# EAGLE board LinTempCont_4ch_V1_0 (EAGLE 6.5.0)
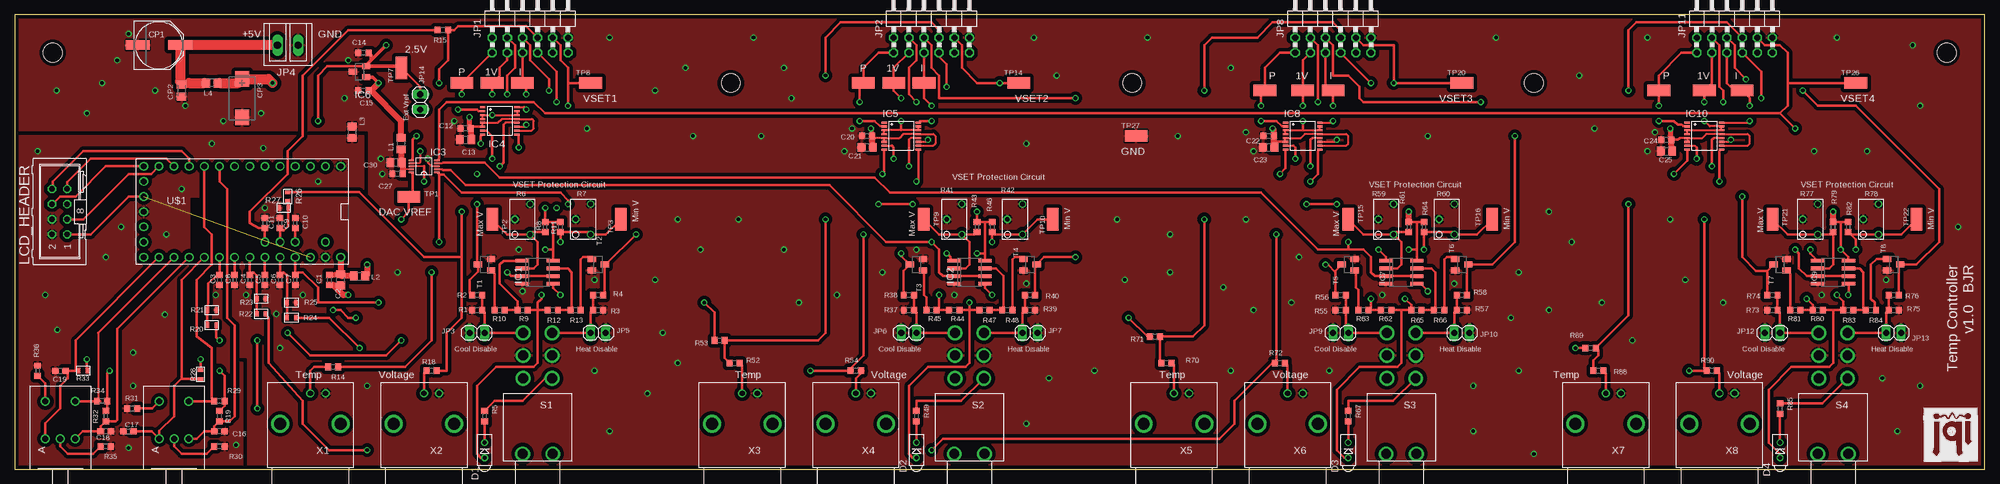
[diagram p5: board, top side]
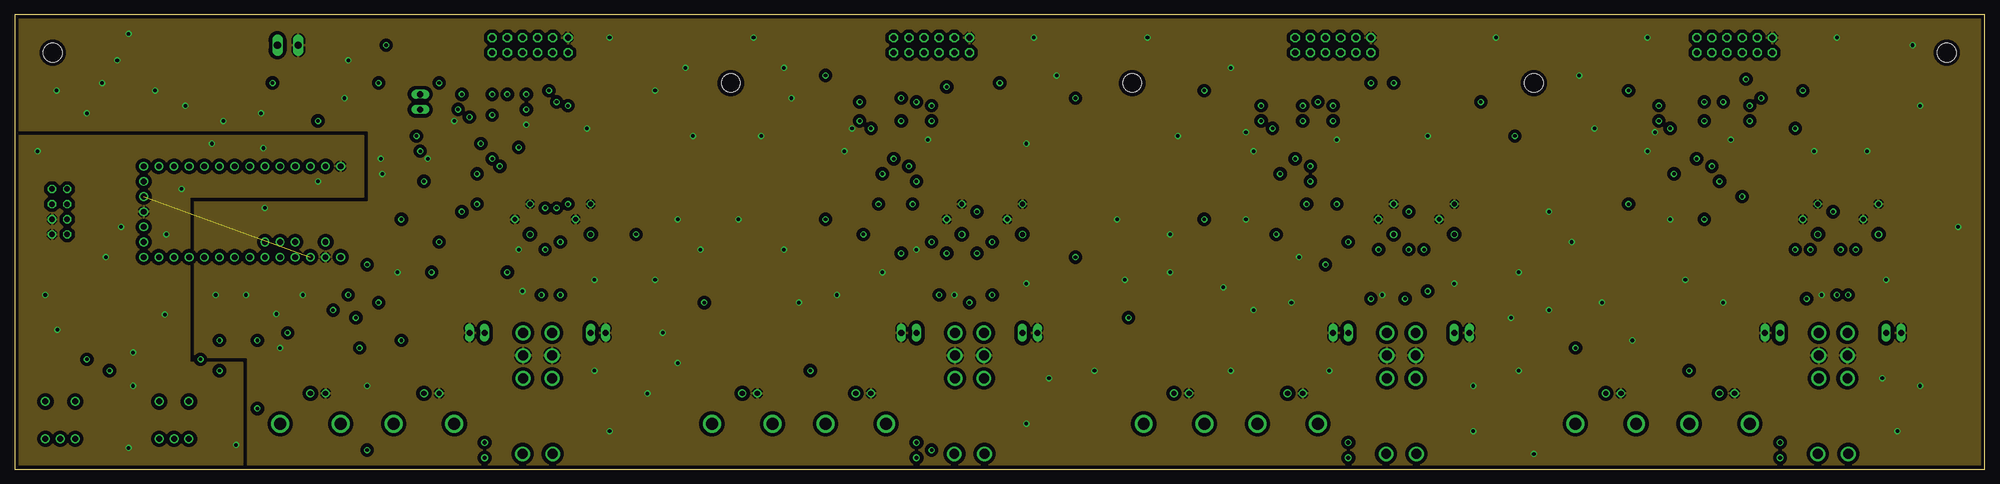
[diagram p6: board, inner layer Route2]
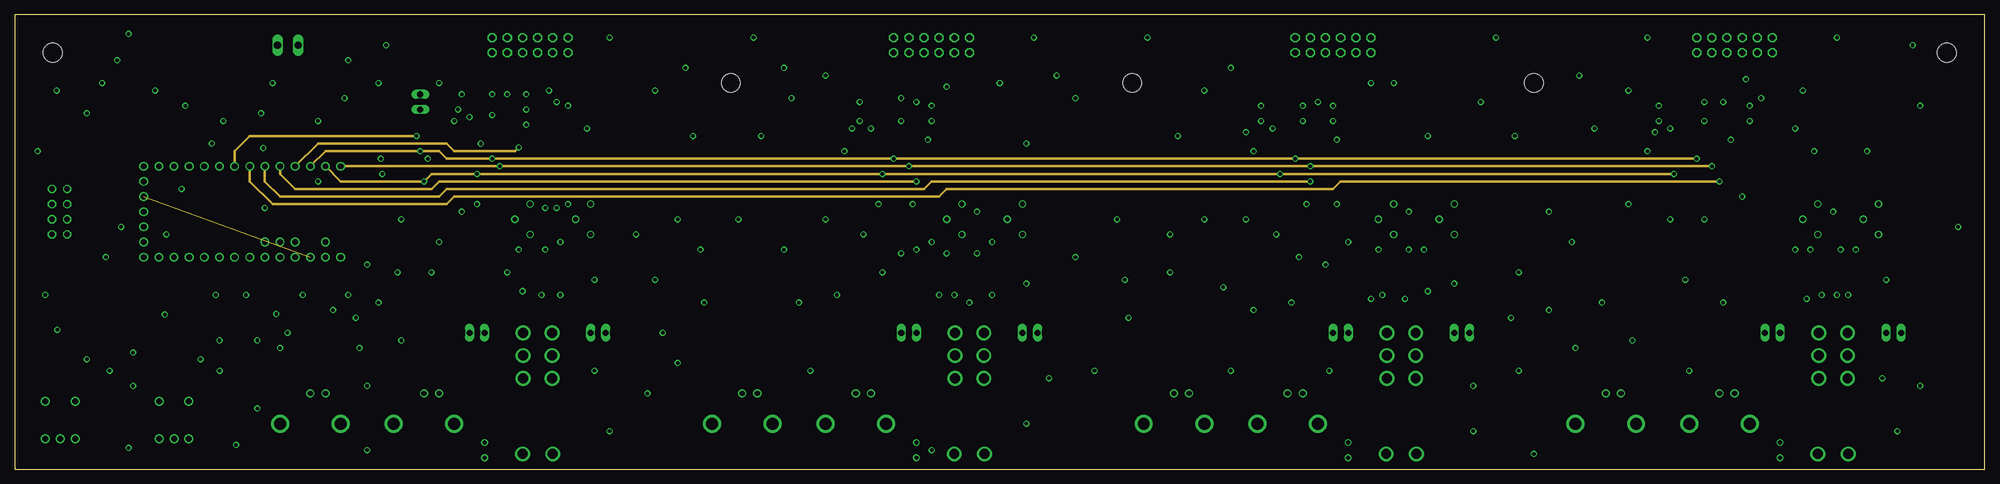
[diagram p7: board, inner layer Route15]
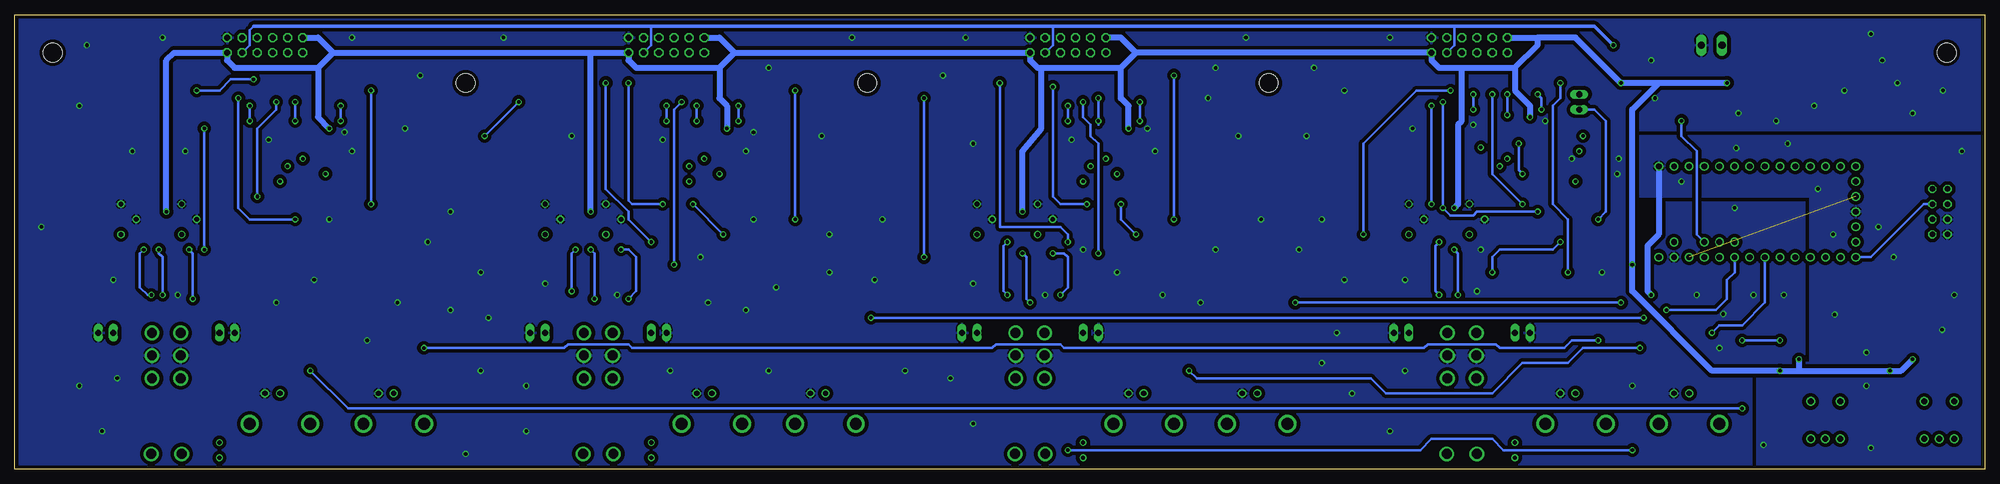
[diagram p8: board, bottom side, seen from below]

Size 330.2 x 76.2 mm. Coordinates in mm from the lower left corner, seen from the top.
Outline: 0,0 330.2,0 330.2,76.2 0,76.2 0,0
Copper layers (1+2*15+16): Top 0.0178mm / dielectric 12mil / Route2 0.0356mm / dielectric 28mil / Route15 0.0356mm / dielectric 12mil / Bottom 0.0178mm
Design rules "SSC-EAGLE-4Lyr_v1.0.0.3": minimum track width 6mil, minimum drill 8mil, track to track 6mil, track to pad 6mil, pad to pad 6mil, via to via 6mil, smd to smd 6mil, copper to edge 20mil, drill to drill 16mil, minimum pad ring 8mil, minimum via ring 8mil, stop-mask expansion 3mil, vias tented up to drill 0mil, thermal gap 10mil
Holes 3.17 mm at 6.35,69.85 323.85,69.85 254.63,64.77 187.32,64.77 120.02,64.77

## Footprints (pad centres in the part's own frame; a part is rotated, then mirrored left to right if it is on the bottom)
0603 = smd 1 x 1.1: 1 -0.85,0; 2 0.85,0
0805 = smd 1.3 x 1.5: 1 -0.95,0; 2 0.95,0
C0603 = smd 1.1 x 1: 1 -0.85,0; 2 0.85,0
PANASONIC_F = smd 4 x 1.6: + 3.55,0; - -3.55,0
C0805K = smd 1.3 x 1.6: 1 -1,0; 2 1,0
CT7343 = smd 2.6 x 2.4: + -3.2,0; - 3.2,0
HLMP--F0010 = drill 0.7: A 1.27,0; C -1.27,0
PEC092320FS = drill 1: A 0,-2.5; B 0,2.5; C 0,0; D -6.25,-2.5; E -6.25,2.5
SO08 = smd 2.2 x 0.6: 1 -2.6,1.905; 2 -2.6,0.635; 3 -2.6,-0.635; 4 -2.6,-1.905; 5 2.6,-1.905; 6 2.6,-0.635; 7 2.6,0.635; 8 2.6,1.905
MSOP10 = smd 0.9 x 0.3: 1 -2.16,1; 2 -2.16,0.5; 3 -2.16,0; 4 -2.16,-0.5; 5 -2.16,-1; 6 2.16,-1; 7 2.16,-0.5; 8 2.16,0; 9 2.16,0.5; 10 2.16,1
TSSOP16 = smd 0.9 x 0.35: 1 -2.875,2.275; 2 -2.875,1.625; 3 -2.875,0.975; 4 -2.875,0.325; 5 -2.875,-0.325; 6 -2.875,-0.975; 7 -2.875,-1.625; 8 -2.875,-2.275; 9 2.875,-2.275; 10 2.875,-1.625; 11 2.875,-0.975; 12 2.875,-0.325; 13 2.875,0.325; 14 2.875,0.975; 15 2.875,1.625; 16 2.875,2.275
SOT-23 = smd 1.4 x 1: 1 -1.1,0.95; 2 -1.1,-0.95; 3 1.1,0
2X06/90 = drill 1.016 octagon: 1 -6.35,-6.35; 2 -6.35,-3.81; 3 -3.81,-6.35; 4 -3.81,-3.81; 5 -1.27,-6.35; 6 -1.27,-3.81; 7 1.27,-6.35; 8 1.27,-3.81; 9 3.81,-6.35; 10 3.81,-3.81; 11 6.35,-6.35; 12 6.35,-3.81
1X02 = drill 1.016 long: 1 -1.27,0; 2 1.27,0
1X02_SCRWTRM = drill 1.2 long: 1 -1.79,-0.01; 2 1.71,-0.01
ML08 = drill 0.914 octagon: 1 -3.81,-1.143; 2 -3.81,1.397; 3 -1.27,-1.143; 4 -1.27,1.397; 5 1.27,-1.143; 6 1.27,1.397; 7 3.81,-1.143; 8 3.81,1.397
64WPOT = drill 0.8: P$1 -1.27,2.54; P$2 1.27,0; P$3 -1.27,-2.54
R_0603 = smd 0.6 x 0.9: P$1 -0.75,0; P$2 0.75,0
E-SWITCH-100-M7 = drill 1.651: P$1 2.413,0; P$2 2.413,-3.81; P$3 2.413,-7.62; P$4 -2.413,0; P$5 -2.413,-3.81; P$6 -2.413,-7.62; P$7 -2.54,12.7; P$8 2.54,12.7
1206TESTPAD = smd 3.81 x 1.93: P$1 0,0
TEENSY_3.1+4 = drill 0.965: 0 -7.62,15.24; 1 -7.62,12.7; 2 -7.62,10.16; 3 -7.62,7.62; 3.3V 7.62,12.7; 3.3V1 -2.54,-15.24; 4 -7.62,5.08; 5 -7.62,2.54; 6 -7.62,0; 7 -7.62,-2.54; 8 -7.62,-5.08; 9 -7.62,-7.62; 10 -7.62,-10.16; 11 -7.62,-12.7; 12 -7.62,-15.24; 13 7.62,-15.24; 14/A0 7.62,-12.7; 15/A1 7.62,-10.16; 16/A2 7.62,-7.62; 17/A3 7.62,-5.08; 18/A4 7.62,-2.54; 19/A5 7.62,0; 20/A6 7.62,2.54; 21/A7 7.62,5.08; 22/A8 7.62,7.62; 23/A9 7.62,10.16; A10 5.08,7.62; A11 5.08,5.08; A14 5.08,-15.24; AGND 7.62,15.24; AREF 5.08,10.16; GND -7.62,17.78; GND1 0,-15.24; PGM 2.54,-15.24; VBAT -5.08,-15.24; VIN 7.62,17.78; VUSB 5.08,15.24
BNC90 = drill 0.9 pad 1.27: 1 0,-5.08; 2 -2.54,-5.08 | drill 2 pad 2.032: ANCHOR1 -5.08,0; ANCHOR2 5.08,0

## Placement (x,y rotation side)
C1  0.1uF  [0603]  52.7,31.75 90 top
C2  10uF  [0805]  54.61,31.75 90 top
C3  0.1uF  [0603]  34.29,31.75 90 top
C4  0.1uF  [0603]  39.37,31.75 90 top
C5  0.1uF  [0603]  41.91,31.75 90 top
C6  0.1uF  [0603]  44.45,31.75 90 top
C7  0.1uF  [0603]  46.99,31.75 90 top
C8  0.1uF  [0603]  36.83,31.75 90 top
C9  0.1uF  [0603]  44.45,41.27 270 top
C10  1000pF  [0603]  46.99,41.27 270 top
C11  0.1uF  [0603]  41.91,41.27 270 top
C12  0.1uF  [0603]  75.56,57.15 0 top
C13  10uF  [0805]  75.56,55.24 0 top
C14  1000pF  [0603]  58.42,69.85 0 top
C15  0.1uF  [0603]  58.42,63.5 0 top
C16  10nF  [C0603]  34.29,6.35 180 top
C17  10nF  [C0603]  19.05,6.35 0 top
C18  10nF  [C0603]  15.24,6.35 180 top
C19  10nF  [C0603]  7.62,16.51 0 top
C20  0.1uF  [0603]  142.88,55.88 0 top
C21  10uF  [0805]  142.88,53.98 0 top
C22  0.1uF  [0603]  210.19,55.88 0 top
C23  10uF  [0805]  210.19,53.98 0 top
C24  0.1uF  [0603]  276.86,55.24 0 top
C25  10uF  [0805]  276.86,53.34 0 top
C27  0.1uF  [0603]  64.14,49.53 0 top
C30  10uF  [0805]  63.88,51.44 0 top
CP1  220uF  [PANASONIC_F]  24.13,71.12 0 top
CP2  10uF  [C0805K]  27.94,63.5 270 top
CP3  47uF  [CT7343]  38.1,62.23 270 top
D1  [HLMP--F0010]  78.74,3.17 270 top
D2  [HLMP--F0010]  151.13,3.17 270 top
D3  [HLMP--F0010]  223.52,3.17 270 top
D4  [HLMP--F0010]  295.91,3.17 270 top
ENC1  PEC09  [PEC092320FS]  26.67,5.08 270 top
ENC2  PEC09  [PEC092320FS]  7.62,5.08 270 top
IC1  LM393D  [SO08]  87.63,33.02 0 top
IC2  LM393D  [SO08]  160.02,33.02 0 top
IC3  AD5624R  [MSOP10]  68.58,50.8 180 top
IC4  AD5262  [TSSOP16]  81.28,58.42 0 top
IC5  AD5262  [TSSOP16]  148.59,55.88 0 top
IC6  [SOT-23]  57.78,66.67 180 top
IC7  LM393D  [SO08]  232.41,33.02 0 top
IC8  AD5262  [TSSOP16]  215.9,55.88 0 top
IC9  LM393D  [SO08]  304.8,33.02 0 top
IC10  AD5262  [TSSOP16]  283.21,55.88 0 top
JP1  [2X06/90]  86.36,76.2 0 top
JP2  [2X06/90]  153.67,76.2 0 top
JP3  [1X02]  77.47,22.86 180 top
JP4  [1X02_SCRWTRM]  45.72,71.12 180 top
JP5  [1X02]  97.79,22.86 0 top
JP6  [1X02]  149.86,22.86 180 top
JP7  [1X02]  170.18,22.86 0 top
JP8  [2X06/90]  220.98,76.2 0 top
JP9  [1X02]  222.25,22.86 180 top
JP10  [1X02]  242.57,22.86 0 top
JP11  [2X06/90]  288.29,76.2 0 top
JP12  [1X02]  294.64,22.86 180 top
JP13  [1X02]  314.96,22.86 0 top
JP14  [1X02]  67.94,61.59 90 top
L1  Ferrite 1k  [0805]  64.77,54.61 90 top
L2  Ferrite 1k  [0805]  57.78,32.38 0 top
L3  Ferrite 1k  [0805]  56.52,56.52 270 top
L4  Ferrite 1k  [0805]  33.02,64.77 180 top
LCD_HEADER  [ML08]  7.62,43.18 90 top
R1  4.3k  [0603]  77.47,26.67 0 top
R2  1.5k  [0603]  77.47,29.21 180 top
R3  4.3k  [0603]  97.79,26.67 180 top
R4  1.5k  [0603]  97.79,29.21 0 top
R5  330  [0603]  78.74,8.89 270 top
R6  10k  [64WPOT]  85.09,41.91 180 top
R7  10k  [64WPOT]  95.25,41.91 180 top
R8  10k  [0603]  88.9,40.64 90 top
R9  10k  [0603]  85.09,26.67 0 top
R10  10k  [0603]  81.28,26.67 0 top
R11  33k  [0603]  91.44,40.64 90 top
R12  10k  [0603]  90.17,26.67 180 top
R13  10k  [0603]  93.98,26.67 180 top
R14  1.0k  [0603]  53.34,17.14 180 top
R15  1.0k  [0603]  71.75,73.66 180 top
R18  1.0k  [0603]  69.85,16.51 180 top
R19  10k  [0603]  34.29,8.89 90 top
R20  10k 1%  [R_0603]  33.02,24.13 0 top
R21  10k 1%  [R_0603]  33.02,26.67 180 top
R22  10k 1%  [R_0603]  41.27,26.04 0 top
R23  10k 1%  [R_0603]  41.27,28.57 180 top
R24  10k 1%  [R_0603]  46.35,25.4 0 top
R25  10k 1%  [R_0603]  46.35,27.94 180 top
R26  10k 1%  [R_0603]  45.72,45.72 90 top
R27  10k 1%  [R_0603]  45.09,43.81 0 top
R28  10k  [R_0603]  31.11,15.88 90 top
R29  10k  [0603]  34.29,11.43 0 top
R30  50  [0603]  34.29,3.81 180 top
R31  50  [0603]  19.68,10.16 0 top
R32  10k  [0603]  15.24,8.89 90 top
R33  10k  [R_0603]  11.43,16.51 0 top
R34  10k  [0603]  14.61,11.43 0 top
R35  50  [0603]  15.24,3.81 180 top
R36  50  [0603]  3.81,16.51 270 top
R37  4.3k  [0603]  149.86,26.67 0 top
R38  1.5k  [0603]  149.86,29.21 180 top
R39  4.3k  [0603]  170.18,26.67 180 top
R40  1.5k  [0603]  170.18,29.21 0 top
R41  10k  [64WPOT]  157.48,41.91 180 top
R42  10k  [64WPOT]  167.64,41.91 180 top
R43  10k  [0603]  161.29,40.64 90 top
R44  10k  [0603]  157.48,26.67 0 top
R45  10k  [0603]  153.67,26.67 0 top
R46  33k  [0603]  163.83,40.64 90 top
R47  10k  [0603]  162.56,26.67 180 top
R48  10k  [0603]  166.37,26.67 180 top
R49  330  [0603]  151.13,8.89 270 top
R52  1.0k  [0603]  120.65,17.78 0 top
R53  1.0k  [0603]  118.11,21.59 180 top
R54  1.0k  [0603]  140.97,16.51 0 top
R55  4.3k  [0603]  222.25,26.67 0 top
R56  1.5k  [0603]  222.25,29.21 180 top
R57  4.3k  [0603]  242.57,26.67 180 top
R58  1.5k  [0603]  242.57,29.21 0 top
R59  10k  [64WPOT]  229.87,41.91 180 top
R60  10k  [64WPOT]  240.03,41.91 180 top
R61  10k  [0603]  233.68,40.64 90 top
R62  10k  [0603]  229.87,26.67 0 top
R63  10k  [0603]  226.06,26.67 0 top
R64  33k  [0603]  236.22,40.64 90 top
R65  10k  [0603]  234.95,26.67 180 top
R66  10k  [0603]  238.76,26.67 180 top
R67  330  [0603]  223.52,8.89 270 top
R70  1.0k  [0603]  193.04,17.78 0 top
R71  1.0k  [0603]  191.13,22.23 180 top
R72  1.0k  [0603]  212.09,17.78 0 top
R73  4.3k  [0603]  294.64,26.67 0 top
R74  1.5k  [0603]  294.64,29.21 180 top
R75  4.3k  [0603]  314.96,26.67 180 top
R76  1.5k  [0603]  314.96,29.21 0 top
R77  10k  [64WPOT]  300.99,41.91 180 top
R78  10k  [64WPOT]  311.15,41.91 180 top
R79  10k  [0603]  304.8,40.64 90 top
R80  10k  [0603]  302.26,26.67 0 top
R81  10k  [0603]  298.45,26.67 0 top
R82  33k  [0603]  307.34,40.64 90 top
R83  10k  [0603]  307.34,26.67 180 top
R84  10k  [0603]  311.15,26.67 180 top
R85  330  [0603]  295.91,10.16 270 top
R88  1.0k  [0603]  265.43,16.51 0 top
R89  1.0k  [0603]  264.16,20.32 180 top
R90  1.0k  [0603]  284.48,16.51 0 top
S1  [E-SWITCH-100-M7]  87.63,15.24 180 top
S2  [E-SWITCH-100-M7]  160.02,15.24 180 top
S3  [E-SWITCH-100-M7]  232.41,15.24 180 top
S4  [E-SWITCH-100-M7]  304.8,15.24 180 top
T1  MMBT3904  [SOT-23]  78.74,34.29 180 top
T2  MMBT3904  [SOT-23]  97.79,34.29 0 top
T3  MMBT3904  [SOT-23]  151.13,34.29 180 top
T4  MMBT3904  [SOT-23]  170.18,34.29 0 top
T5  MMBT3904  [SOT-23]  223.52,34.29 180 top
T6  MMBT3904  [SOT-23]  242.57,34.29 0 top
T7  MMBT3904  [SOT-23]  295.91,34.29 180 top
T8  MMBT3904  [SOT-23]  314.96,34.29 0 top
TP1  TESTPT  [1206TESTPAD]  66.04,45.72 0 top
TP2  TESTPT  [1206TESTPAD]  80.01,41.91 90 top
TP3  TESTPT  [1206TESTPAD]  101.6,41.91 90 top
TP4  TESTPT  [1206TESTPAD]  74.93,64.77 0 top
TP5  TESTPT  [1206TESTPAD]  80.01,64.77 0 top
TP6  TESTPT  [1206TESTPAD]  85.09,64.77 0 top
TP7  TESTPT  [1206TESTPAD]  64.77,67.31 90 top
TP8  TESTPT  [1206TESTPAD]  96.52,64.77 0 top
TP9  TESTPT  [1206TESTPAD]  152.4,41.91 90 top
TP10  TESTPT  [1206TESTPAD]  173.99,41.91 90 top
TP11  TESTPT  [1206TESTPAD]  142.24,64.77 0 top
TP12  TESTPT  [1206TESTPAD]  147.32,64.77 0 top
TP13  TESTPT  [1206TESTPAD]  152.4,64.77 0 top
TP14  TESTPT  [1206TESTPAD]  168.28,64.77 0 top
TP15  TESTPT  [1206TESTPAD]  223.52,41.91 90 top
TP16  TESTPT  [1206TESTPAD]  247.65,41.91 90 top
TP17  TESTPT  [1206TESTPAD]  209.55,63.5 0 top
TP18  TESTPT  [1206TESTPAD]  215.9,63.5 0 top
TP19  TESTPT  [1206TESTPAD]  220.98,63.5 0 top
TP20  TESTPT  [1206TESTPAD]  242.57,64.77 0 top
TP21  TESTPT  [1206TESTPAD]  294.64,41.91 90 top
TP22  TESTPT  [1206TESTPAD]  318.77,41.91 90 top
TP23  TESTPT  [1206TESTPAD]  275.59,63.5 0 top
TP24  TESTPT  [1206TESTPAD]  283.21,63.5 0 top
TP25  TESTPT  [1206TESTPAD]  289.56,63.5 0 top
TP26  TESTPT  [1206TESTPAD]  308.61,64.77 0 top
TP27  TESTPT  [1206TESTPAD]  187.96,55.88 0 top
U$1  TEENSY_3.1+4  [TEENSY_3.1+4]  36.83,43.18 270 top
U$2  [JQI_LOGO_NEGATIVE-SILKSCREEN]  320.04,1.27 0 top
X1  BNC-H  [BNC90]  49.53,7.62 180 top
X2  BNC-H  [BNC90]  68.58,7.62 180 top
X3  BNC-H  [BNC90]  121.92,7.62 180 top
X4  BNC-H  [BNC90]  140.97,7.62 180 top
X5  BNC-H  [BNC90]  194.31,7.62 180 top
X6  BNC-H  [BNC90]  213.36,7.62 180 top
X7  BNC-H  [BNC90]  266.7,7.62 180 top
X8  BNC-H  [BNC90]  285.75,7.62 180 top

## Tracks (layer width: path | path; a pad name or v marks a point on that pad's centre or on a via)
2.5V  (via drill 0.6, 0.6 pad 0.3)
  Top 0.406: IC6.2 52.38,67.62 50.8,66.04 v50.8,58.42 | 47.2,40.64 C10.2 U$1.AREF | JP14.2 67.94,64.14 TP7.P$1
  Top 0.61: 59.69,68.58 58.88,67.78 IC6.2 64.45,67.62 TP7.P$1 | 59.69,68.58 59.69,69.43 C14.2 | 59.69,68.58 v62.23,71.12
  Bottom 0.406: JP1.9 88.9,71.12 88.9,74.3 | JP2.9 156.21,71.12 156.21,74.3 | JP8.9 223.52,71.12 223.52,74.3 | JP11.9 290.83,71.12 290.83,73.66 290.19,74.3 | v50.8,58.42 50.8,55.88 48.26,53.34 48.26,39.37 U$1.AREF
  Bottom 0.61: v62.23,71.12 65.41,74.3 88.9,74.3 156.21,74.3 223.52,74.3 290.19,74.3
3.3V  (1 unrouted)
  Top 0.406: LCD_HEADER.1 12.7,39.37 19.05,45.72 U$1.3.3V1
+1V_1  (via drill 0.6 pad 0.41)
  Top 0.305: IC4.15 IC4.14 v80.01,59.4 IC4.3 IC4.4
  Top 0.406: JP1.3 82.55,68.58 81.28,67.31 81.28,66.04 TP5.P$1 v80.01,62.87
  Bottom 0.406: v80.01,62.87 v80.01,59.4
+1V_2  (via drill 0.6 pad 0.3)
  Top 0.305: IC5.4 IC5.3 148.59,56.85 IC5.14 IC5.15
  Top 0.406: JP2.3 147.32,67.31 TP12.P$1 147.32,63.5 v148.59,62.23 | v148.59,58.42 148.59,56.85
  Bottom 0.406: v148.59,62.23 v148.59,58.42 148.59,57.78
+1V_3  (via drill 0.6)
  Top 0.305: IC8.4 IC8.3 215.9,56.85 IC8.14 IC8.15
  Top 0.406: JP8.3 215.9,68.58 TP18.P$1 v215.9,60.96 | v215.9,58.42 215.9,56.85
  Bottom 0.406: v215.9,60.96 v215.9,58.42
+1V_4  (via drill 0.6)
  Top 0.305: IC10.4 IC10.3 IC10.14 IC10.15 284.12,57.51
  Top 0.406: JP11.3 284.48,64.77 TP24.P$1 v283.21,61.59 | 284.12,57.51 v283.21,58.42
  Bottom 0.406: v283.21,58.42 v283.21,61.59
+5V
  Top 1.016: 27.94,64.77 CP2.1 28.94,64.5 29.21,64.77 | 31.75,64.77 L4.2
  Top 1.676: JP4.2 CP1.+ 27.68,65.03 27.94,64.77 | 29.21,64.77 31.75,64.77
ACT_T1
  Top 0.406: U$1.A11 C11.2 40.85,40.42 39.37,41.27 39.37,43.18 45.72,49.53 45.72,53.34 48.26,55.88 48.26,66.04 55.88,73.66 R15.2
ACT_T2  (via drill 0.6, 0.6 pad 0.41)
  Top 0.406: U$1.23/A9 C7.2 47.41,33.02 48.26,33.02 50.8,30.48 50.8,27.94 v60.96,27.94 | R53.2 117.26,26.25 v115.57,27.94
  Bottom 0.406: v115.57,27.94 v60.96,27.94
ACT_T3  (via drill 0.6, 0.6 pad 0.3)
  Top 0.406: C5.2 U$1.21/A7 | v53.34,26.67 54.61,26.67 55.88,25.4 v57.15,25.4 | R71.2 189.87,22.23 v186.69,25.4
  Bottom 0.406: U$1.21/A7 41.91,33.02 43.18,31.75 43.18,28.57 45.09,26.67 v53.34,26.67 | v57.15,25.4 v186.69,25.4
ACT_T4  (via drill 0.6, 0.6 pad 0.3)
  Top 0.406: C8.2 U$1.19/A5 | v45.72,22.86 49.53,19.05 62.23,19.05 v64.77,21.59 | R89.2 v261.62,20.32
  Bottom 0.406: U$1.19/A5 36.83,27.94 40.64,24.13 44.45,24.13 v45.72,22.86 | v64.77,21.59 69.22,21.59 70.48,20.32 81.28,20.32 81.92,20.95 93.34,20.95 93.98,20.32 154.31,20.32 154.94,20.95 165.74,20.95 166.37,20.32 226.69,20.32 227.33,20.95 237.49,20.95 238.12,20.32 v261.62,20.32
AGND  (via drill 0.6)
  Top 0.254: 71.12,50.8 IC3.3 69.85,50.8 69.22,51.44 v69.22,52.07
  Top 0.305: IC4.11 85.39,57.45 v85.72,57.78 | IC5.11 152.69,54.91 v153.03,55.24 | IC8.11 221.28,54.91 v221.62,55.24 | IC10.11 287.31,54.91 v287.65,55.24
  other vias: 73.66,58.42 85.09,29.84 33.66,29.21 61.59,49.53 61.34,52.07 55.88,68.58 55.24,62.23 28.57,60.96 34.92,58.42 41.27,59.69 23.5,63.5 17.14,68.58 19.05,73.03 140.34,57.15 139.06,53.34 207.65,53.34 206.38,56.52 274.95,56.52 273.69,53.34 84.45,36.83 97.16,31.75 313.69,31.75 302.89,29.21 169.54,31.11 241.3,31.11 229.24,29.21 157.48,29.21 151.13,36.83 48.26,29.21 44.45,20.32 43.81,26.04 38.73,29.21 41.91,43.81 14.61,64.77 6.99,63.5 12.06,59.69 107.31,63.5 112.39,67.31 130.18,62.23 128.91,67.31 113.67,55.88 125.09,55.88 111.12,41.91 114.94,36.83 121.28,41.91 131.44,27.94 128.91,36.83 107.31,31.75 108.58,22.86 97.16,16.51 106.05,12.7 111.12,17.78 64.14,33.02 59.05,13.97 189.87,72.39 99.69,6.35 137.79,29.21 145.41,33.02 169.54,7.62 173.35,15.24 180.97,16.51 186.06,31.75 193.68,33.02 184.78,41.91 193.68,39.37 194.94,55.88 169.54,54.61 174.62,66.04 170.81,72.39 123.83,72.39 99.69,72.39 203.84,67.31 206.38,41.91 202.56,30.48 207.65,26.67 215.26,35.56 214,27.94 203.84,16.51 220.34,16.51 244.47,13.97 244.47,6.35 254.63,2.54 252.09,16.51 250.82,25.4 252.09,33.02 257.18,26.67 266.06,27.94 257.18,43.18 260.99,38.1 264.8,57.15 236.85,55.88 262.25,66.04 248.28,72.39 273.69,72.39 277.5,41.91 280.04,31.75 271.14,21.59 286.38,27.94 310.51,53.34 305.44,72.39 318.13,71.12 319.4,60.96 325.75,40.64 319.4,13.97 313.06,15.24 315.6,6.35 301.62,53.34 95.89,57.15
  pour Bottom (isolate 0.61, rank 2): -7.62,78.74 337.82,78.74 337.82,-8.89 -7.62,-8.89 -7.62,-7.62
  pour Top (isolate 0.61, rank 2): -7.62,78.74 337.82,78.74 337.82,-8.89 -7.62,-8.89 -7.62,-7.62
  pour Route2 (isolate 0.61, rank 2): -7.62,78.74 337.82,78.74 337.82,-8.89 -7.62,-8.89 -7.62,-7.62
CS_DAC  (via drill 0.6)
  Top 0.305: IC3.6 66.67,52.05
  Top 0.406: v67.31,55.88 66.67,55.24 66.67,52.05
  Route15 0.406: U$1.6 36.83,53.34 39.37,55.88 v67.31,55.88
CS_LCD
  Top 0.406: LCD_HEADER.6 6.35,44.45 7.62,45.72 10.16,45.72 15.24,50.8 U$1.12
CS_POT1  (via drill 0.6)
  Top 0.305: 84.45,55.84 IC4.9
  Top 0.406: v84.45,53.98 84.45,55.84
  Route15 0.406: U$1.2 50.8,54.61 72.39,54.61 73.66,53.34 83.82,53.34 v84.45,53.98
CS_POT2  (via drill 0.6 pad 0.41)
  Top 0.406: IC5.9 151.47,48.59 v151.13,48.26
  Route15 0.406: U$1.3 44.45,49.53 46.99,46.99 69.85,46.99 71.12,48.26 v151.13,48.26
CS_POT3  (via drill 0.6 pad 0.41)
  Top 0.305: 218.44,53.27 IC8.9
  Top 0.406: v217.17,48.26 218.44,49.53 218.44,53.27
  Route15 0.406: U$1.4 41.91,48.26 44.45,45.72 71.12,45.72 72.39,46.99 152.4,46.99 153.67,48.26 v217.17,48.26
CS_POT4  (via drill 0.6 pad 0.41)
  Top 0.406: v285.75,48.26 285.75,53.27 IC10.9
  Route15 0.406: U$1.5 39.37,48.26 43.18,44.45 72.39,44.45 73.66,45.72 154.94,45.72 156.21,46.99 220.98,46.99 222.25,48.26 v285.75,48.26
DGND  (via drill 0.6, 0.6 pad 0.3, 0.6 pad 0.41)
  Top 0.305: IC4.12 82.22,58.09 | IC10.12 284.79,55.55 | IC5.12 150.17,55.55 149.86,55.24 | IC8.12 217.48,55.55
  Top 0.406: 82.22,58.09 81.92,57.78 81.92,51.44 v81.28,50.8 | 284.79,55.55 284.48,55.24 v284.48,50.8 | 149.86,55.24 v149.86,50.8 | 217.48,55.55 217.17,55.24 v217.17,50.8
  Top 1.016: C2.1 53.34,30.9 | 53.34,30.9 C1.1 | v55.88,29.21 55.03,29.21 53.34,30.9
  Route15 0.406: U$1.GND v81.28,50.8 v149.86,50.8 v217.17,50.8 v284.48,50.8
  Bottom 1.016: U$1.GND 54.61,39.37 56.52,37.47 56.52,29.84 v55.88,29.21
  other vias: 33.02,54.61 5.08,29.21 25.4,39.37 27.94,46.99 15.24,35.56 17.78,40.64 3.81,53.34 41.66,53.85 50.8,48.26 7.11,23.37 19.81,19.56 25.15,25.91 19.81,13.97 19.05,3.56 37.08,4.06
  pour Bottom (isolate 0.61): -12.7,55.88 -12.7,-13.97 38.1,-13.97 38.1,17.78 29.21,17.78 29.21,45.72 58.42,45.72 58.42,55.88
  pour Bottom (isolate 0.61): -12.7,55.88 -12.7,-13.97 38.1,-13.97 38.1,17.78 29.21,17.78 29.21,45.72 58.42,45.72 58.42,55.88
  pour Top (isolate 0.61): -12.7,55.88 -12.7,-13.97 38.1,-13.97 38.1,17.78 29.21,17.78 29.21,45.72 58.42,45.72 58.42,55.88
  pour Route2 (isolate 0.61): -12.7,55.88 -12.7,-13.97 38.1,-13.97 38.1,17.78 29.21,17.78 29.21,45.72 58.42,45.72 58.42,55.88
ENC_A1
  Top 0.406: C17.2 22.9,6.35 ENC1.A 24.17,6.39 26.67,8.89 26.67,13.97 27.94,15.24 | U$1.17/A3 27.94,31.75 27.94,15.24 | R28.P$1 28.05,15.12 27.94,15.24
ENC_A2
  Top 0.406: ENC2.A 5.12,7.66 7.62,10.16 7.62,13.97 8.89,15.24 8.89,16.09 C19.2 10.16,16.51 | U$1.14/A0 10.16,21.59 10.16,16.51 | R33.P$1 10.16,16.51
ENC_B1
  Top 0.406: ENC1.B 30.48,5.08 31.75,6.35 C16.2 33.44,7.19 R19.1 35.98,8.04 36.83,8.89 36.83,24.13 35.56,25.4 35.56,46.99 34.29,48.26 U$1.7
ENC_B2
  Top 0.406: U$1.16/A2 17.14,23.5 17.14,8.26 16.93,8.04 R32.1 14.39,7.19 C18.2 11.39,6.35 ENC2.B
ENC_SW1
  Top 0.406: ENC1.E 33.34,11.33 R29.1 33.02,11.85 33.02,20.32 30.48,22.23 30.48,31.75 33.02,34.29 33.02,39.37 31.75,40.64 U$1.8
ENC_SW2
  Top 0.305: 13.97,22.86 13.97,11.85
  Top 0.406: ENC2.E 14.29,11.33 R34.1 13.97,11.85 | U$1.15/A1 13.97,22.86
I1  (via drill 0.6 pad 0.41)
  Top 0.305: IC4.16 85.36,60.7 | 85.72,64.14 TP6.P$1
  Top 0.406: TP6.P$1 JP1.5 | 85.36,60.7 v85.72,60.33 | v85.72,62.87 85.72,64.14
  Bottom 0.406: v85.72,60.33 v85.72,62.87
I2  (via drill 0.6 pad 0.3)
  Top 0.305: 151.73,58.42 IC5.16
  Top 0.406: JP2.5 TP13.P$1 152.4,62.23 v153.67,60.96 | v153.67,58.42 151.73,58.42
  Bottom 0.406: v153.67,60.96 v153.67,58.42
I3  (via drill 0.6)
  Top 0.305: IC8.16 220.72,58.16
  Top 0.406: JP8.5 219.71,63.5 TP19.P$1 v220.98,60.96 | 220.72,58.16 v220.98,58.42
  Bottom 0.406: v220.98,58.42 v220.98,60.96
I4  (via drill 0.6)
  Top 0.305: IC10.16 290.56,58.16 v290.83,58.42
  Top 0.406: JP11.5 287.02,64.77 288.29,63.5 TP25.P$1 290.83,62.23 v290.83,60.96
  Bottom 0.406: v290.83,58.42 v290.83,60.96
LIMA1  (via drill 0.6)
  Top 0.406: JP1.4 83.82,71.12 83.82,67.31 82.55,66.04 v82.55,62.87 | v77.47,44.45 77.47,34.46 T1.3 77.64,33.19 76.2,31.75 76.2,29.63 R2.2
  Bottom 0.406: v82.55,62.87 82.55,49.53 v77.47,44.45
LIMA2  (via drill 0.6 pad 0.3)
  Top 0.406: R38.2 149.01,33.27 T3.3 148.59,35.73 v148.59,36.2 | JP2.4 151.13,71.12 151.13,68.58 149.86,67.31 149.86,62.87 v151.13,61.59
  Bottom 0.406: v151.13,61.59 151.13,59.05 149.86,57.78 149.86,55.88 148.59,54.61 v148.59,36.2
LIMA3  (via drill 0.6)
  Top 0.406: JP8.4 218.44,71.12 v218.44,61.59 | R56.2 221.4,33.02 | 221.4,33.02 221.4,33.27 T5.3 | v219.71,34.29 220.13,34.29 221.4,33.02
  Bottom 0.406: v218.44,61.59 219.71,60.33 v219.71,34.29
LIMA4  (via drill 0.6)
  Top 0.406: R74.2 293.79,33.27 | 293.79,33.27 T7.3 | JP11.4 285.75,71.12 285.75,64.14 286.38,63.5 v286.38,61.59 | 293.79,33.27 291.85,33.27 289.56,35.56 v289.56,45.72
  Bottom 0.406: v286.38,61.59 286.38,60.33 289.56,57.15 v289.56,45.72
LIMB1  (via drill 0.6)
  Top 0.406: JP1.6 86.36,71.12 86.36,68.58 89.53,65.41 v89.53,63.5 | R4.2 98.89,29.46 T2.3 99.06,34.46 99.23,34.46 v104.14,39.37
  Bottom 0.406: v89.53,63.5 95.25,63.5 104.14,54.61 v104.14,39.37
LIMB2  (via drill 0.6 pad 0.3)
  Top 0.406: R40.2 171.03,34.04 T4.3 172.55,35.56 v177.8,35.56 | JP2.6 153.67,71.12 153.67,67.31 154.94,66.04 154.94,62.23 v177.8,62.23
  Bottom 0.406: v177.8,62.23 v177.8,35.56
LIMB3  (via drill 0.6)
  Top 0.406: JP8.6 220.98,71.12 220.98,66.04 223.52,66.04 225.43,64.14 225.43,62.23 226.06,61.59 v245.75,61.59 | R58.2 243.42,34.04 T6.3 247.65,34.29 251.46,38.1 v251.46,55.88
  Bottom 0.406: v251.46,55.88 v245.75,61.59
LIMB4  (via drill 0.6)
  Top 0.406: R76.2 315.81,34.04 T8.3 318.77,34.29 322.58,38.1 322.58,46.99 308.61,60.96 302.26,60.96 v299.72,63.5 | JP11.6 288.29,71.12 288.29,67.31 v290.19,65.41
  Bottom 0.406: v290.19,65.41 294,65.41 295.91,63.5 v299.72,63.5
MOSI
  Top 0.406: LCD_HEADER.3 11.43,41.91 19.05,49.53 22.86,49.53 U$1.11
MOSI_B  (via drill 0.6, 0.6 pad 0.3, 0.6 pad 0.41)
  Top 0.254: 68.58,50.8 IC3.8
  Top 0.305: 78.11,55.84 IC4.8
  Top 0.406: v68.58,48.26 68.58,50.8 | IC10.8 280.33,51.73 v278.13,49.53 | IC5.8 145.72,49.83 v145.41,49.53 | v78.11,54.61 78.11,55.84 | IC8.8 213.03,50.47 v212.09,49.53
  Route15 0.406: U$1.0 54.61,48.26 v68.58,48.26 69.85,49.53 v77.47,49.53 v145.41,49.53 v212.09,49.53 v278.13,49.53
  Bottom 0.406: v77.47,49.53 78.11,50.16 v78.11,54.61
N$1  (via drill 0.6)
  Top 0.305: IC3.10 66.42,49.78 66.67,49.53 | 66.67,46.35 TP1.P$1 66.42,46.1
  Top 0.406: 66.67,49.53 66.67,46.35 | v64.77,41.91 66.04,43.18 TP1.P$1
  Bottom 0.406: JP14.1 65.41,60.33 63.5,58.42 63.5,43.18 v64.77,41.91
N$3
  Top 0.406: R2.1 R1.2 78.74,26.25 JP3.1 S1.P$3
N$4
  Top 0.406: R14.2 50.16,17.14 49.53,16.51 X1.1
N$5
  Top 0.406: R4.1 R3.2 96.52,26.25 JP5.1 S1.P$6
N$6
  Top 0.406: R8.1 86.78,39.79 R6.P$1 | R6.P$1 82.55,39.37 TP2.P$1 | IC1.2 87,33.66 87.63,34.29 87.63,38.1 R6.P$1
N$7  (via drill 0.6)
  Top 0.406: TP3.P$1 99.06,39.37 R7.P$1 96.1,39.79 R11.1 v91.44,38.1 | IC1.5 90.23,30.42 v91.44,29.21
  Bottom 0.406: v91.44,29.21 92.08,29.84 92.08,37.47 v91.44,38.1
N$8
  Top 0.406: R12.1 R13.2 93.34,26.89 93.34,33.02 92.71,33.66 IC1.7
N$9
  Top 0.406: R10.2 R9.1 84.24,28.16 81.28,31.11 81.28,34.29 81.92,34.92 IC1.1
N$10
  Top 0.406: R10.1 80.43,32.75 T1.1
N$11
  Top 0.406: R13.1 94.83,35.14 95.25,35.56 96.37,35.56 T2.1
N$12
  Top 0.406: R5.2 D1.C
N$13
  Top 0.406: S1.P$4 88.9,15.24 85.09,11.43 80.43,11.43 R5.1
N$14
  Top 0.406: X2.1 68.58,16.09 R18.2
N$15
  Top 0.406: ENC1.C 26.67,3.81 27.94,2.54 32.17,2.54 R30.2
N$16
  Top 0.406: R31.2 23,10.16 ENC1.D
N$17
  Top 0.406: ENC2.C 7.62,3.81 8.89,2.54 13.12,2.54 R35.2
N$19
  Top 0.406: ENC2.D 5.12,14.35 R36.2
N$21
  Top 0.406: S2.P$3 JP6.1 151.13,26.25 R37.2 R38.1
N$22
  Top 0.406: S2.P$6 JP7.1 168.91,26.25 R39.2 R40.1
N$23
  Top 0.406: IC2.2 159.38,33.66 160.02,34.29 160.02,38.1 R41.P$1 | R41.P$1 160.87,39.37 R43.1 | R41.P$1 154.94,39.37 TP9.P$1
N$24
  Top 0.254: IC3.9 65.48,50.3
  Top 0.305: 65.48,50.3 64.98,50.8
  Top 1.016: C27.2 64.98,50.8 C30.2 64.77,51.5 L1.1
N$25
  Top 1.016: L2.1 54.83,32.38 C2.2 | C1.2 C2.2 | U$1.VIN C2.2
N$26  (via drill 0.6 pad 0.3)
  Top 0.406: IC2.1 156.84,34.92 156.84,35.56 v156.21,36.2 | R44.1 R45.2 154.94,27.09 v154.94,29.21
  Bottom 0.406: v156.21,36.2 154.31,36.2 153.67,35.56 153.67,30.48 v154.94,29.21
N$27
  Top 0.406: R45.1 152.82,28.79 152.4,29.21 152.4,33.17 T3.1
N$28  (via drill 0.6 pad 0.3)
  Top 0.406: IC2.5 162.62,30.42 v163.83,29.21 | v163.83,38.1 R46.1 164.25,39.37 R42.P$1 171.45,41.91 TP10.P$1
  Bottom 0.406: v163.83,29.21 164.47,29.84 164.47,37.47 v163.83,38.1
N$29
  Top 0.406: R47.1 R48.2 165.74,26.89 165.74,32.38 164.47,33.66 IC2.7
N$30
  Top 0.406: R48.1 167.22,35.14 167.64,35.56 168.76,35.56 T4.1
N$31
  Top 0.406: R49.2 D2.C
N$32
  Top 0.406: R49.1 151.13,11.43 158.62,11.43 S2.P$4
N$35  (via drill 0.6)
  Top 0.406: JP2.8 154.94,73.66 153.67,74.93 138.43,74.93 135.89,72.39 v135.89,66.04 | R52.1 118.96,18.62 R53.1 134.62,21.59 135.89,22.86 v135.89,41.91
  Bottom 0.406: v135.89,66.04 v135.89,41.91
N$36
  Top 0.406: X3.1 121.92,17.36 R52.2
N$37
  Top 0.406: X4.1 140.97,15.24 142.24,16.51 R54.2
N$38
  Top 0.406: R56.1 R55.2 223.1,23.28 JP9.1 S3.P$3
N$39
  Top 0.406: S3.P$6 JP10.1 241.3,26.25 R57.2 R58.1
N$40
  Top 0.406: R61.1 231.56,39.79 R59.P$1 | R59.P$1 226.06,39.37 TP15.P$1 | IC7.2 231.78,33.66 232.41,34.29 232.41,38.1 R59.P$1
N$41  (via drill 0.6)
  Top 0.406: R62.1 R63.2 227.33,27.09 v227.33,28.57 | IC7.1 229.81,35.62 v228.6,36.83
  Bottom 0.406: v228.6,36.83 227.33,36.83 226.06,35.56 226.06,29.84 v227.33,28.57
N$42
  Top 0.406: R63.1 225.21,30.06 224.79,30.48 224.79,33.17 T5.1
N$43  (via drill 0.6)
  Top 0.406: IC7.5 235.59,31.11 v236.85,29.84 | v236.22,36.83 R64.1 240.88,39.79 R60.P$1 245.11,39.37 TP16.P$1
  Bottom 0.406: v236.85,29.84 236.85,36.2 v236.22,36.83
N$44
  Top 0.406: R65.1 R66.2 238.12,26.89 238.12,33.02 237.49,33.66 IC7.7
N$45
  Top 0.406: T6.1 241.15,35.56 240.03,35.56 239.61,35.14 R66.1
N$46
  Top 0.406: R67.2 D3.C
N$47
  Top 0.406: R67.1 223.52,11.43 231.01,11.43 S3.P$4
N$50  (via drill 0.6)
  Top 0.406: JP8.8 222.25,73.66 220.98,74.93 210.82,74.93 208.28,72.39 200.66,72.39 199.39,71.12 v199.39,63.5 | v199.39,41.91 199.39,24.13 197.49,22.23 R71.1 191.99,17.98 R70.1
  Bottom 0.406: v199.39,63.5 v199.39,41.91
N$51
  Top 0.406: X5.1 194.31,17.36 R70.2
N$52
  Top 0.406: X6.1 213.36,17.36 R72.2
N$53
  Top 0.406: S4.P$3 JP12.1 295.91,26.25 R73.2 R74.1
N$54
  Top 0.406: R76.1 R75.2 313.69,26.25 JP13.1 S4.P$6
N$55
  Top 0.406: TP21.P$1 297.18,39.37 R77.P$1 304.38,39.37 R79.1 304.8,34.29 304.17,33.66 IC9.2
N$56  (via drill 0.6)
  Top 0.406: R81.2 R80.1 301.41,27.52 v300.36,28.57 | v300.99,36.83 300.99,36.13 IC9.1
  Bottom 0.406: v300.36,28.57 300.36,36.2 v300.99,36.83
N$57
  Top 0.406: R81.1 297.6,32.75 T7.1
N$58  (via drill 0.6)
  Top 0.406: 307.76,39.37 R78.P$1 316.23,39.37 TP22.P$1 | 307.76,39.37 R82.1 | IC9.5 307.4,29.27 v307.34,29.21 | v308.61,36.83 308.61,38.52 307.76,39.37
  Bottom 0.406: v307.34,29.21 307.98,29.21 309.25,30.48 309.25,36.2 v308.61,36.83
N$59
  Top 0.406: R83.1 R84.2 309.88,27.09 309.88,33.02 309.25,33.66 IC9.7
N$60
  Top 0.406: T8.1 312.1,35.24 311.15,34.29 311.15,28.57 311.79,27.94 311.79,26.89 R84.1
N$61
  Top 0.406: R85.2 D4.C
N$62
  Top 0.406: R85.1 302.98,11.01 S4.P$4
N$65  (via drill 0.6)
  Top 0.406: R88.1 264.58,18.2 265.43,19.05 265.43,19.9 R89.1 270.51,25.82 v270.51,44.45 | JP11.8 287.02,74.93 271.78,74.93 270.51,73.66 v270.51,63.5
  Bottom 0.406: v270.51,63.5 v270.51,44.45
N$66
  Top 0.406: X7.1 266.7,16.09 R88.2
N$67
  Top 0.406: X8.1 285.75,16.09 R90.2
N$69  (via drill 0.6 pad 0.41)
  Top 0.406: JP1.8 85.72,74.3 74.3,74.3 73.66,73.66 R15.1 72.61,68.58 71.12,67.09 v71.12,64.77 | v69.85,33.02 69.85,21.59 65.41,17.14 R14.1
  Bottom 0.406: v69.85,33.02 69.85,41.91 72.39,44.45 72.39,60.96 71.12,62.23 v71.12,64.77
P1  (via drill 0.6 pad 0.41)
  Top 0.305: 75.56,64.14 TP4.P$1 | IC4.2 77.75,60.05
  Top 0.406: TP4.P$1 JP1.1 | 77.75,60.05 77.47,60.33 v74.3,60.33 | v74.93,62.87 74.93,63.5 75.56,64.14
  Bottom 0.406: v74.3,60.33 74.3,62.23 v74.93,62.87
P2  (via drill 0.6 pad 0.3)
  Top 0.305: IC5.2 145.06,57.51 144.15,58.42
  Top 0.406: JP2.1 144.78,69.85 142.24,67.31 TP11.P$1 141.6,64.14 v141.6,61.59 | 144.15,58.42 v141.6,58.42
  Bottom 0.406: v141.6,58.42 v141.6,61.59
P3  (via drill 0.6)
  Top 0.305: IC8.2 212.37,57.51 | 208.91,62.87 TP17.P$1
  Top 0.406: JP8.1 212.09,69.85 209.55,67.31 TP17.P$1 | 212.37,57.51 211.46,58.42 v208.91,58.42 | v208.91,60.96 208.91,62.87
  Bottom 0.406: v208.91,58.42 v208.91,60.96
P4  (via drill 0.6)
  Top 0.305: IC10.2 279.68,57.51 279.4,57.78
  Top 0.406: JP11.1 279.4,69.85 275.59,66.04 TP23.P$1 v275.59,60.96 | 279.4,57.78 278.76,57.78 278.13,58.42 v275.59,58.42
  Bottom 0.406: v275.59,58.42 v275.59,60.96
RS_LCD
  Top 0.406: U$1.10 25.4,52.07 12.7,52.07 8.76,48.13 LCD_HEADER.7
RST_LCD
  Top 0.406: U$1.9 29.21,52.07 27.94,53.34 11.43,53.34 6.35,48.26 6.35,47.12 LCD_HEADER.8
SCK
  Bottom 0.406: U$1.13 19.05,35.56 10.16,44.45 LCD_HEADER.5
SCK_B  (via drill 0.6, 0.6 pad 0.3, 0.6 pad 0.41)
  Top 0.254: IC3.7 67.81,51.3 67.94,51.44
  Top 0.305: IC4.7 79.09,56.8 | IC10.7 281.66,54.26 281.94,53.98 | IC5.7 147.04,54.26 | IC8.7 214.35,54.26 | v67.94,53.34 67.94,51.44
  Top 0.406: 79.09,56.8 80.01,55.88 v80.01,52.07 | 281.94,53.98 v281.94,52.07 | 147.04,54.26 147.32,53.98 v147.32,52.07 | 214.35,54.26 214.63,53.98 v214.63,52.07
  Route15 0.406: U$1.1 52.07,53.34 v67.94,53.34 71.12,53.34 72.39,52.07 v80.01,52.07 v147.32,52.07 v214.63,52.07 v281.94,52.07
VDD  (via drill 0.6, 0.6 pad 0.3, 0.6 pad 0.41)
  Top 0.305: IC4.6 IC4.5 80.95,58.09 81.61,58.74 IC4.13 86.67,58.74 87,58.42 87,57.15 86.64,56.8 IC4.10 | IC5.6 IC5.5 | IC5.5 144.03,55.55 143.72,55.24 | IC5.5 148.26,55.55 148.91,56.2 IC5.13 153.98,56.2 154.31,55.88 154.31,54.61 153.95,54.26 IC5.10 | IC8.6 IC8.5 215.57,55.55 216.22,56.2 IC8.13 223.19,56.2 223.52,55.88 223.52,54.61 223.16,54.26 IC8.10 | IC10.5 279.07,55.55 | 278.13,55.24 277.5,55.88 | IC10.5 IC10.6 | IC10.5 282.88,55.55 283.54,56.2 IC10.13 290.5,56.2 290.83,55.88 290.83,54.61 290.48,54.26 IC10.10
  Top 0.406: R19.2 35.14,10.59 R29.2 35.14,15.66 v34.29,16.51 | R12.2 87.63,26.67 | 87.63,26.67 R9.2 | D1.A 78.11,1.91 77.47,2.54 77.47,13.97 80.64,17.14 87,17.14 87.63,17.78 87.63,26.67 | 90.17,41.49 R8.2 v88.9,43.81 | 90.17,41.49 R11.2 | IC1.8 90.23,36.83 | 90.23,36.83 90.23,41.43 90.17,41.49 | v88.9,36.83 90.23,36.83 | IC4.6 76.71,57.45 C12.2 76.2,57.37 | D2.A 150.5,1.91 149.86,2.54 149.86,13.97 153.03,17.14 159.38,17.14 160.02,17.78 160.02,26.67 | 160.02,26.67 R44.2 | R47.2 160.02,26.67 | 162.56,41.49 R43.2 v161.29,43.18 | 162.56,41.49 R46.2 | 162.62,36.2 IC2.8 162.56,34.92 | 162.62,36.2 162.62,41.43 162.56,41.49 | v160.02,27.94 160.02,26.67 | v88.27,29.21 88.27,28.57 87.63,27.94 87.63,26.67 | IC8.6 211.33,54.91 211.03,54.61 | D3.A 222.88,1.91 221.62,3.17 221.62,13.34 225.43,17.14 231.78,17.14 232.41,17.78 232.41,26.67 | 232.41,26.67 R62.2 | 232.41,26.67 R65.2 234.1,27.52 v233.04,28.57 | R64.2 234.95,41.49 | 234.95,41.49 R61.2 | IC7.8 235.01,36.83 | 235.01,36.83 235.01,41.43 234.95,41.49 | v233.68,36.83 235.01,36.83 | v161.29,36.2 162.62,36.2 | D4.A 295.91,2.54 294,4.45 294,13.34 297.81,17.14 304.17,17.14 304.8,17.78 304.8,26.67 | 304.8,26.67 R80.2 | 304.8,26.67 R83.2 306.49,28.16 v305.44,29.21 | R79.2 306.07,41.49 | 306.07,41.49 R82.2 | 279.07,55.55 278.76,55.24 278.13,55.24 | 306.07,41.49 v306.07,36.83 307.34,35.56 307.34,34.98 IC9.8 | R32.2 15.46,9.96 R34.2 15.46,16.09 v15.88,16.51 | 12.06,16.39 R33.P$2 12.06,16.62 v12.06,18.41 | R28.P$2 v31.11,18.41
  Top 0.61: C20.2 143.72,56.94 v143.51,57.15 | IC6.1 60.01,65.72 v60.96,64.77
  Top 0.813: 76.2,57.15 76.2,57.37 v76.2,59.05 | v277.5,57.15 277.5,55.88 277.5,55.46 C24.2
  Top 1.016: L4.1 34.29,64.77 | C12.2 C13.2 | C15.2 59.69,63.5 | 59.69,63.5 64.77,58.42 L1.2 | C21.2 143.72,55.24 C20.2 | 59.69,63.5 v60.96,64.77 | C23.2 211.03,54.61 C22.2 211.03,56.94 v210.82,57.15 | R61.2 v233.68,43.18 | C25.2 C24.2 | R79.2 v304.8,43.18 | v59.05,34.29 59.05,32.7 L2.2
  Top 1.676: 34.29,64.77 37.44,64.77 CP3.+ 42.52,65.43 v43.18,64.77
  Bottom 0.406: v88.27,29.21 88.27,36.2 v88.9,36.83 | v161.29,36.2 160.66,35.56 160.66,28.57 v160.02,27.94 | v233.04,28.57 233.04,36.2 v233.68,36.83 | v306.07,36.83 306.07,36.2 305.44,35.56 v305.44,29.21
  Bottom 1.016: JP1.2 74.93,72.39 | 87.63,67.31 91.44,67.31 92.71,68.58 JP1.11 142.24,69.85 | 87.63,67.31 78.74,67.31 | 78.74,67.31 74.93,71.12 74.93,72.39 | 142.24,69.85 144.78,72.39 JP2.2 | 158.12,67.31 158.75,67.31 160.02,68.58 JP2.11 209.55,69.85 | 158.12,67.31 144.78,67.31 | 144.78,67.31 142.24,69.85 | JP8.2 212.09,72.39 209.55,69.85 | 212.09,67.31 226.06,67.31 227.33,68.58 JP8.11 233.68,69.85 | 212.09,67.31 209.55,69.85 | JP11.2 279.4,72.39 276.86,69.85 | 276.86,69.85 233.68,69.85 | 279.4,67.31 293.37,67.31 294.64,68.58 JP11.11 303.53,69.85 304.8,68.58 v304.8,43.18 | 279.4,67.31 276.86,69.85 | v43.18,64.77 54.61,64.77 | 54.61,64.77 v60.96,64.77 68.58,72.39 74.93,72.39 | 78.74,67.31 78.74,63.5 76.2,60.96 v76.2,59.05 | 54.61,64.77 59.05,60.33 v59.05,34.29 59.05,29.84 45.72,16.51 v34.29,16.51 31.11,16.51 | 31.11,16.51 v15.88,16.51 13.97,16.51 v12.06,18.41 | 87.63,67.31 87.63,58.42 88.27,57.78 88.27,44.45 v88.9,43.81 | v143.51,57.15 143.51,60.96 144.78,62.23 144.78,67.31 | v161.29,43.18 161.29,53.34 158.12,57.15 158.12,67.31 | 212.09,67.31 212.09,62.23 210.82,60.96 v210.82,57.15 | v233.68,43.18 233.68,69.85 | 279.4,67.31 279.4,59.05 v277.5,57.15 | v31.11,18.41 31.11,16.51
VMON1  (via drill 0.6 pad 0.41)
  Top 0.406: JP1.7 90.81,66.67 v90.81,61.59 | 74.93,35.56 74.93,25.4 72.39,22.86 72.39,16.51 R18.1 | R26.P$2 57.67,46.47 68.58,35.56 74.93,35.56 | v74.93,43.18 74.93,35.56
  Bottom 0.406: v90.81,61.59 v90.81,43.81 89.53,42.55 85.72,42.55 85.09,43.18 v74.93,43.18
VMON1_B
  Top 0.406: U$1.A10 C9.2 44.87,40.01 45.09,40.01 45.84,40.76 R27.P$2 45.84,44.85 R26.P$1
VMON2  (via drill 0.6 pad 0.3, 0.6 pad 0.41)
  Top 0.406: R24.P$2 52.7,25.4 v57.78,20.32 | v133.35,16.51 139.7,16.51 | v156.21,64.14 156.21,67.94 154.94,69.22 JP2.7 | v150.5,44.45 v144.78,44.45 | v142.24,39.37 142.24,19.05 139.7,16.51 | 139.7,16.51 R54.1
  Bottom 0.406: v57.78,20.32 67.31,20.32 69.85,17.78 77.47,17.78 82.55,12.7 100.33,12.7 102.87,15.24 132.08,15.24 v133.35,16.51 | v144.78,44.45 144.78,41.91 v142.24,39.37 | v156.21,64.14 156.21,45.72 154.94,44.45 v150.5,44.45
VMON2_B
  Top 0.406: U$1.22/A8 C6.2 44.87,33.02 45.09,33.02 45.6,32.5 R25.P$2 R24.P$1
VMON3  (via drill 0.6, 0.6 pad 0.41)
  Top 0.406: v153.67,3.17 155.57,5.08 201.93,5.08 204.47,7.62 204.47,11.43 210.82,17.78 R72.1 211.46,18 v211.46,39.37 | v59.05,3.17 52.7,3.17 48.26,7.62 48.26,11.43 42.55,17.78 42.55,25.29 R22.P$2 | JP8.7 v227.33,64.77 | v221.62,44.45 v216.53,44.45
  Bottom 0.406: v153.67,3.17 94.61,3.17 92.71,5.08 82.55,5.08 80.64,3.17 v59.05,3.17 | v227.33,64.77 227.33,45.09 226.69,44.45 v221.62,44.45 | v216.53,44.45 v211.46,39.37
VMON3_B
  Top 0.406: U$1.20/A6 C4.2 39.79,33.02 40.01,33.02 40.52,32.5 R23.P$2 R22.P$1
VMON4  (via drill 0.6, 0.6 pad 0.41)
  Top 0.406: v40.64,21.59 v40.64,10.16 | v280.67,16.51 R90.1 283.21,16.93 v283.21,41.91 | JP11.7 292.74,66.67 v292.74,62.23 | R20.P$2 33.77,22.11 v34.29,21.59
  Bottom 0.406: v40.64,10.16 274.32,10.16 v280.67,16.51 | v292.74,62.23 292.74,43.81 290.83,41.91 v283.21,41.91 | v34.29,21.59 v40.64,21.59
VMON4_B
  Top 0.406: U$1.18/A4 C3.2 33.87,32.6 32.38,31.11 32.38,28.05 R21.P$2 R20.P$1
VSET1  (via drill 0.6, 0.6 pad 0.41)
  Top 0.305: 71.12,49.42 IC3.1
  Top 0.406: IC1.6 IC1.3 83.19,32.38 v82.55,33.02 | v71.12,38.1 71.12,49.42 71.86,49.42 74.93,46.35 91.44,46.35 92.71,45.09 v92.71,44.45 | TP8.P$1 92.71,64.77 | 92.71,64.77 92.71,67.31 91.44,68.58 91.44,71.12 JP1.10 | v92.71,60.96 92.71,64.77
  Bottom 0.406: v82.55,33.02 82.55,35.56 81.28,36.83 72.39,36.83 v71.12,38.1 | v92.71,60.96 v92.71,44.45
VSET2  (via drill 0.6 pad 0.3)
  Top 0.305: IC3.2 71.62,50.3 71.75,50.16
  Top 0.406: 71.75,50.16 73.03,50.16 75.56,47.62 136.53,47.62 146.05,38.1 v153.67,38.1 154.94,36.83 154.94,33.02 155.57,32.38 IC2.3 IC2.6 | JP2.10 158.75,71.12 158.75,67.31 161.29,64.77 v165.1,64.77 TP14.P$1
  Bottom 0.406: v165.1,64.77 165.1,40.64 154.94,40.64 153.67,39.37 v153.67,38.1
VSET3  (via drill 0.6)
  Top 0.305: IC3.4 71.62,51.3 71.75,51.44
  Top 0.406: 71.75,51.44 78.74,51.44 81.28,48.9 144.15,48.9 146.69,46.35 208.91,46.35 218.44,36.83 223.52,36.83 | JP8.10 226.06,71.12 231.14,71.12 v231.14,64.77 TP20.P$1 | IC7.6 IC7.3 227.97,32.38 227.33,33.02 227.33,35.56 226.06,36.83 223.52,36.83 | v223.52,38.1 223.52,36.83
  Bottom 0.406: v231.14,64.77 231.14,46.99 227.33,43.18 227.33,41.91 v223.52,38.1
VSET4  (via drill 0.6)
  Top 0.305: IC3.5 70.85,51.8 71.12,52.07
  Top 0.406: 71.12,52.07 71.12,60.33 72.39,61.59 87,61.59 88.9,59.69 295.91,59.69 | IC9.6 IC9.3 300.36,32.38 299.08,33.66 299.08,36.2 v298.45,36.83 | 295.91,59.69 297.18,60.96 297.18,64.77 | 297.18,64.77 297.18,69.85 295.91,71.12 293.37,71.12 JP11.10 | TP26.P$1 297.18,64.77 | v298.45,57.15 295.91,59.69
  Bottom 0.406: v298.45,36.83 v298.45,57.15

## Text on the board
tPlace: +5V | GND | 2.5V | P | 1V | I | P | 1V | I | P | 1V | I | P | 1V | I | VSET1 | VSET2 | VSET3 | VSET4 | Ext Vref | GND | VSET Protection Circuit | VSET Protection Circuit | VSET Protection Circuit | VSET Protection Circuit | Min V | Min V | Min V | Max V | Min V | DAC VREF | Max V | Max V | Max V | Temp Controller / v1.0 BJR | Cool Disable | Heat Disable | Cool Disable | Heat Disable | Cool Disable | Heat Disable | Cool Disable | Heat Disable | Temp | Voltage | Temp | Voltage | Temp | Voltage | Temp | Voltage